# Altium schematic sheet Overview.SchDoc
size A
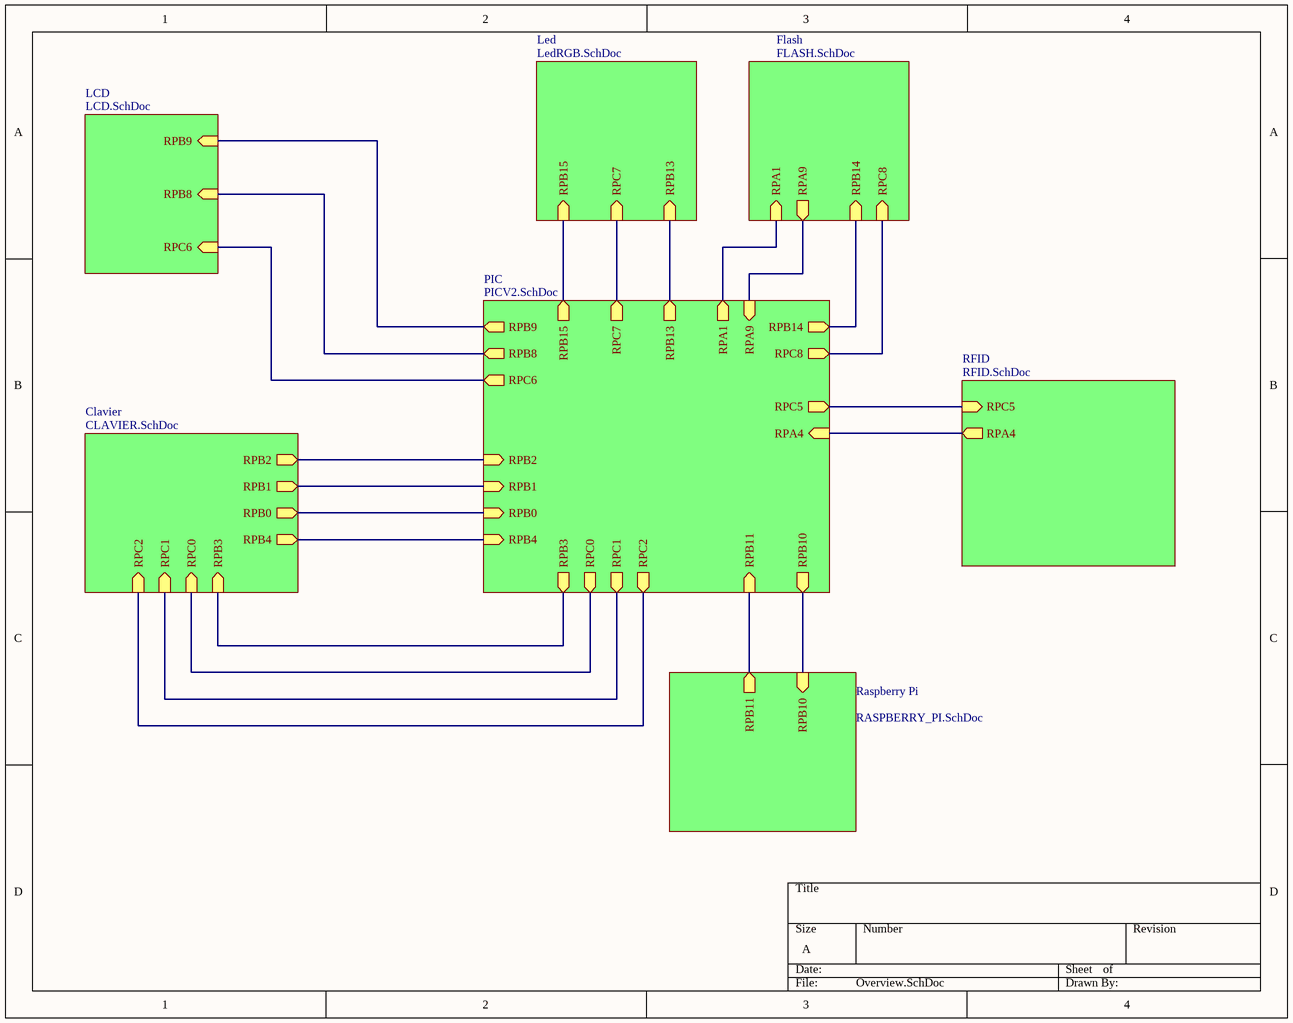
[diagram p0: Overview.SchDoc]

## Sub-sheets
Clavier = CLAVIER.SchDoc: RPB2 (out), RPB1 (out), RPB0 (out), RPB4 (out), RPC1 (in), RPB3 (in), RPC0 (in), RPC2 (in)
Flash = FLASH.SchDoc: RPA1 (in), RPA9 (out), RPB14 (in), RPC8 (in)
LCD = LCD.SchDoc: RPB9 (in), RPB8 (in), RPC6 (in)
Led = LedRGB.SchDoc: RPB15 (in), RPC7 (in), RPB13 (in)
PIC = PICV2.SchDoc: RPB9 (out), RPB8 (out), RPC6 (out), RPB15 (out), RPC7 (out), RPB13 (out), RPA1 (out), RPA9 (in), RPB14 (out), RPC8 (out), RPC5 (out), RPA4 (in), RPB2 (in), RPB1 (in), RPB0 (in), RPB4 (in), RPB3 (out), RPC0 (out), RPC1 (out), RPC2 (out), RPB11 (in), RPB10 (out)
Raspberry Pi = RASPBERRY_PI.SchDoc: RPB11 (out), RPB10 (in)
RFID = RFID.SchDoc: RPC5 (in), RPA4 (out)

## Nets
(unnamed): sheet PIC/RPB9, sheet LCD/RPB9
(unnamed): sheet PIC/RPB8, sheet LCD/RPB8
(unnamed): sheet PIC/RPC6, sheet LCD/RPC6
(unnamed): sheet PIC/RPB15, sheet Led/RPB15
(unnamed): sheet PIC/RPC7, sheet Led/RPC7
(unnamed): sheet PIC/RPB13, sheet Led/RPB13
(unnamed): sheet PIC/RPA1, sheet Flash/RPA1
(unnamed): sheet PIC/RPA9, sheet Flash/RPA9
(unnamed): sheet PIC/RPB14, sheet Flash/RPB14
(unnamed): sheet PIC/RPC8, sheet Flash/RPC8
(unnamed): sheet PIC/RPC5, sheet RFID/RPC5
(unnamed): sheet PIC/RPA4, sheet RFID/RPA4
(unnamed): sheet PIC/RPB2, sheet Clavier/RPB2
(unnamed): sheet PIC/RPB1, sheet Clavier/RPB1
(unnamed): sheet PIC/RPB0, sheet Clavier/RPB0
(unnamed): sheet PIC/RPB4, sheet Clavier/RPB4
(unnamed): sheet PIC/RPB3, sheet Clavier/RPB3
(unnamed): sheet PIC/RPC0, sheet Clavier/RPC0
(unnamed): sheet PIC/RPC1, sheet Clavier/RPC1
(unnamed): sheet PIC/RPC2, sheet Clavier/RPC2
(unnamed): sheet PIC/RPB11, sheet Raspberry Pi/RPB11
(unnamed): sheet PIC/RPB10, sheet Raspberry Pi/RPB10